# Altium schematic sheet LCD.SchDoc: Bison-Board
size A4; DrawnBy: mzy2364; Revision: V1.4
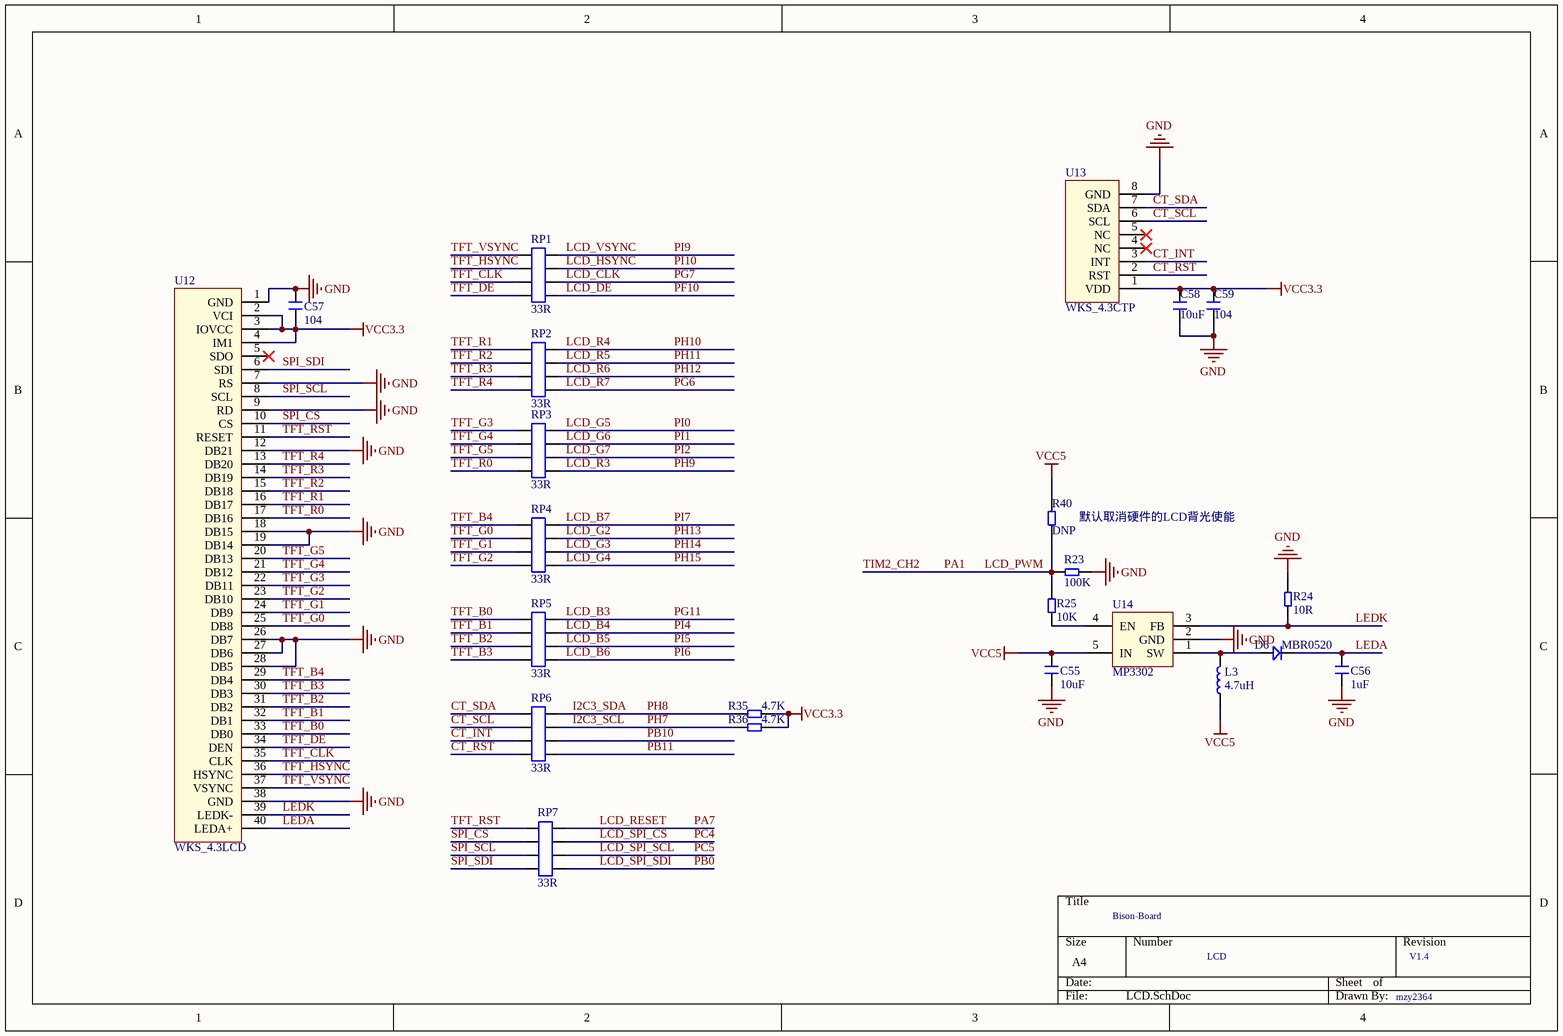
[diagram p0: LCD.SchDoc]

## Parts
C55  10uF  [C 0805]
C56  1uF  [C 0603]
C57  104  [C 0603]
C58  10uF  [C 0805]
C59  104  [C 0603]
D6  MBR0520  [SOD123]
L3  4.7uH  [L_SMNR4030]
R23  100K  [R 0603]
R24  10R  [R 0603]
R25  10K  [R 0603]
R35  4.7K  [R 0603]
R36  4.7K  [R 0603]
R40  DNP  [R 0603]
RP1  33R  [8P4R 0603]
RP2  33R  [8P4R 0603]
RP3  33R  [8P4R 0603]
RP4  33R  [8P4R 0603]
RP5  33R  [8P4R 0603]
RP6  33R  [8P4R 0603]
RP7  33R  [8P4R 0603]
U12  WKS_4.3LCD  [FPC0.5-40P]
U13  WKS_4.3CTP  [FPC0.5-8P]
U14  MP3302  [SOT23-5]

## Nets
GND: C55.1 C56.1 C57.2 C58.1 C59.1 R23.2 R24.2 U12.1(GND) U12.7(RS) U12.9(RD) U12.12(DB21) U12.18(DB15) U12.19(DB14) U12.26(DB7) U12.27(DB6) U12.28(DB5) U12.38(GND) U13.8(GND) U14.2(GND)
VCC3.3: C57.1 C58.2 C59.2 R35.2 R36.2 U12.2(VCI) U12.3(IOVCC) U12.4(IM1) U13.1(VDD)
VCC5: C55.2 L3.2 R40.2 U14.5(IN)
CT_INT: RP6.3 U13.3(INT)
CT_RST: RP6.4 U13.2(RST)
CT_SCL: RP6.2 U13.6(SCL)
CT_SDA: RP6.1 U13.7(SDA)
I2C3_SCL: R36.1 RP6.7  [also labelled PH7]
I2C3_SDA: R35.1 RP6.8  [also labelled PH8]
LCD_B3: RP5.8  [also labelled PG11]
LCD_B4: RP5.7  [also labelled PI4]
LCD_B5: RP5.6  [also labelled PI5]
LCD_B6: RP5.5  [also labelled PI6]
LCD_B7: RP4.8  [also labelled PI7]
LCD_CLK: RP1.6  [also labelled PG7]
LCD_DE: RP1.5  [also labelled PF10]
LCD_G2: RP4.7  [also labelled PH13]
LCD_G3: RP4.6  [also labelled PH14]
LCD_G4: RP4.5  [also labelled PH15]
LCD_G5: RP3.8  [also labelled PI0]
LCD_G6: RP3.7  [also labelled PI1]
LCD_G7: RP3.6  [also labelled PI2]
LCD_HSYNC: RP1.7  [also labelled PI10]
LCD_PWM: R23.1 R25.1 R40.1  [also labelled PA1, TIM2_CH2]
LCD_R3: RP3.5  [also labelled PH9]
LCD_R4: RP2.8  [also labelled PH10]
LCD_R5: RP2.7  [also labelled PH11]
LCD_R6: RP2.6  [also labelled PH12]
LCD_R7: RP2.5  [also labelled PG6]
LCD_RESET: RP7.8  [also labelled PA7]
LCD_SPI_CS: RP7.7  [also labelled PC4]
LCD_SPI_SCL: RP7.6  [also labelled PC5]
LCD_SPI_SDI: RP7.5  [also labelled PB0]
LCD_VSYNC: RP1.8  [also labelled PI9]
LEDA: C56.2 D6.2 U12.40(LEDA+)
LEDK: R24.1 U12.39(LEDK-) U14.3(FB)
PB10: RP6.6
PB11: RP6.5
SPI_CS: RP7.2 U12.10(CS)
SPI_SCL: RP7.3 U12.8(SCL)
SPI_SDI: RP7.4 U12.6(SDI)
TFT_B0: RP5.1 U12.33(DB0)
TFT_B1: RP5.2 U12.32(DB1)
TFT_B2: RP5.3 U12.31(DB2)
TFT_B3: RP5.4 U12.30(DB3)
TFT_B4: RP4.1 U12.29(DB4)
TFT_CLK: RP1.3 U12.35(CLK)
TFT_DE: RP1.4 U12.34(DEN)
TFT_G0: RP4.2 U12.25(DB8)
TFT_G1: RP4.3 U12.24(DB9)
TFT_G2: RP4.4 U12.23(DB10)
TFT_G3: RP3.1 U12.22(DB11)
TFT_G4: RP3.2 U12.21(DB12)
TFT_G5: RP3.3 U12.20(DB13)
TFT_HSYNC: RP1.2 U12.36(HSYNC)
TFT_R0: RP3.4 U12.17(DB16)
TFT_R1: RP2.1 U12.16(DB17)
TFT_R2: RP2.2 U12.15(DB18)
TFT_R3: RP2.3 U12.14(DB19)
TFT_R4: RP2.4 U12.13(DB20)
TFT_RST: RP7.1 U12.11(RESET)
TFT_VSYNC: RP1.1 U12.37(VSYNC)
NetD6_1: D6.1 L3.1 U14.1(SW)
NetR25_2: R25.2 U14.4(EN)

Not connected (* = marked no-connect by the designer): U12 5(SDO)*; U13 4(NC)* 5(NC)*

## Notes on the sheet
- (near R40) 默认取消硬件的LCD背光使能
- LCD

## Library data of the parts
C55-C59 = CAP
D6 = Diode
L3 = L
R23-R25 R35 R36 R40 = RES
RP1-RP7 = RP
U14 = MP3302: LED驱动IC